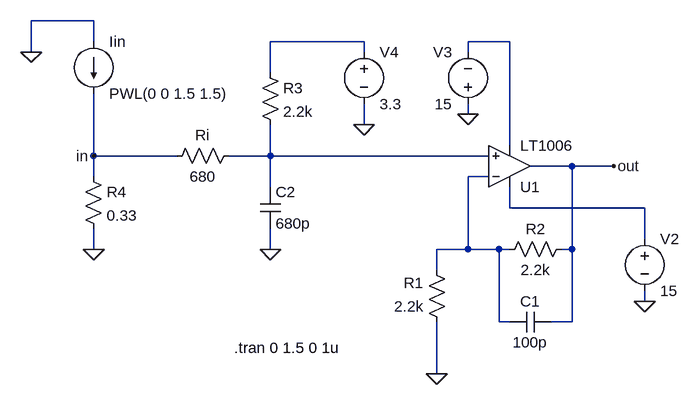
[diagram p0: schematic circuit.asc]
circuit.asc, the LTspice schematic file:
Version 4
SHEET 1 888 680
WIRE -336 -288 -432 -288
WIRE -336 -256 -336 -288
WIRE 80 -256 -64 -256
WIRE 304 -256 240 -256
WIRE -432 -240 -432 -288
WIRE 80 -240 80 -256
WIRE 240 -240 240 -256
WIRE -64 -208 -64 -256
WIRE 240 -144 240 -160
WIRE 80 -128 80 -160
WIRE 304 -96 304 -256
WIRE -336 -80 -336 -176
WIRE -208 -80 -336 -80
WIRE -64 -80 -64 -128
WIRE -64 -80 -128 -80
WIRE 272 -80 -64 -80
WIRE 400 -64 336 -64
WIRE 464 -64 400 -64
WIRE -336 -48 -336 -80
WIRE 272 -48 240 -48
WIRE -64 -32 -64 -80
WIRE 304 0 304 -32
WIRE 512 0 304 0
WIRE 512 48 512 0
WIRE -336 64 -336 32
WIRE -64 64 -64 32
WIRE 240 64 240 -48
WIRE 240 64 192 64
WIRE 288 64 240 64
WIRE 304 64 288 64
WIRE 400 64 400 -64
WIRE 400 64 384 64
WIRE 192 96 192 64
WIRE 512 144 512 128
WIRE 288 176 288 64
WIRE 304 176 288 176
WIRE 400 176 400 64
WIRE 400 176 368 176
WIRE 192 256 192 176
FLAG 192 256 0
FLAG -336 64 0
FLAG 512 144 0
FLAG 240 -144 0
FLAG 464 -64 out
FLAG 80 -128 0
FLAG -64 64 0
FLAG -432 -240 0
FLAG -336 -80 in
SYMBOL res -112 -96 R90
WINDOW 0 0 56 VBottom 2
WINDOW 3 32 56 VTop 2
SYMATTR InstName Ri
SYMATTR Value 680
SYMBOL res 208 192 R180
WINDOW 0 36 76 Left 2
WINDOW 3 36 40 Left 2
SYMATTR InstName R1
SYMATTR Value 2.2k
SYMBOL res 288 80 R270
WINDOW 0 32 56 VTop 2
WINDOW 3 0 56 VBottom 2
SYMATTR InstName R2
SYMATTR Value 2.2k
SYMBOL cap 368 160 R90
WINDOW 0 0 32 VBottom 2
WINDOW 3 32 32 VTop 2
SYMATTR InstName C1
SYMATTR Value 100p
SYMBOL Opamps\\LT1006 304 0 M180
SYMATTR InstName U1
SYMBOL voltage 512 32 R0
WINDOW 123 0 0 Left 2
WINDOW 39 0 0 Left 2
SYMATTR InstName V2
SYMATTR Value 15
SYMBOL voltage 240 -144 R180
WINDOW 0 24 96 Left 2
WINDOW 3 24 16 Left 2
WINDOW 123 0 0 Left 2
WINDOW 39 0 0 Left 2
SYMATTR InstName V3
SYMATTR Value 15
SYMBOL cap -80 -32 R0
SYMATTR InstName C2
SYMATTR Value 680p
SYMBOL res -80 -224 R0
SYMATTR InstName R3
SYMATTR Value 2.2k
SYMBOL voltage 80 -256 R0
WINDOW 123 0 0 Left 2
WINDOW 39 0 0 Left 2
SYMATTR InstName V4
SYMATTR Value 3.3
SYMBOL current -336 -256 R0
WINDOW 123 0 0 Left 2
WINDOW 39 0 0 Left 2
SYMATTR InstName Iin
SYMATTR Value PWL(0 0 1.5 1.5)
SYMBOL res -352 -64 R0
SYMATTR InstName R4
SYMATTR Value 0.33
TEXT -120 216 Left 2 !.tran 0 1.5 0 1u

The netlist it stands for:
* circuit.asc
Ri N003 in 680
R1 0 N004 2.2k
R2 N004 out 2.2k
C1 out N004 100p
XU1 N003 N004 N005 N002 out LT1006  ; pins In+ In- V+ V- OUT
V2 N005 0 15
V3 0 N002 15
C2 N003 0 680p
R3 N001 N003 2.2k
V4 N001 0 3.3
Iin 0 in PWL(0 0 1.5 1.5)
R4 in 0 0.33
.tran 0 1.5 0 1u
.lib LTC.lib
.backanno
.end

* Results of the author's LTspice run, read from the files saved beside the schematic
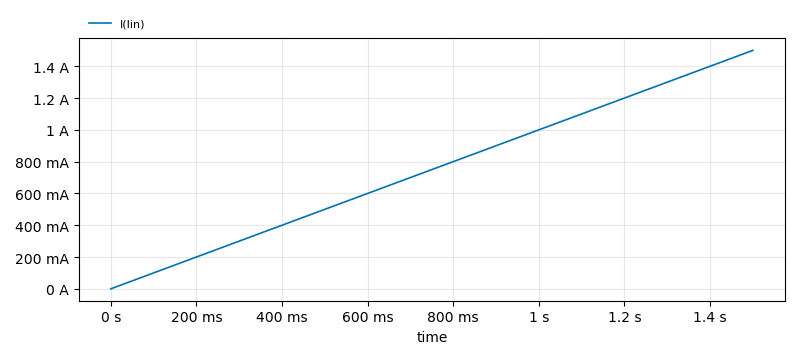
[diagram p1: Transient Analysis of circuit.asc, plotted from the saved traces]
* Transient Analysis, 1 run:
*   I(Iin): min 0 A, max 1.5 A, average 750 mA, rms 866 mA, last 1.5 A